# EAGLE design MRCS-Occupancy-Display (EAGLE 7.7.0)
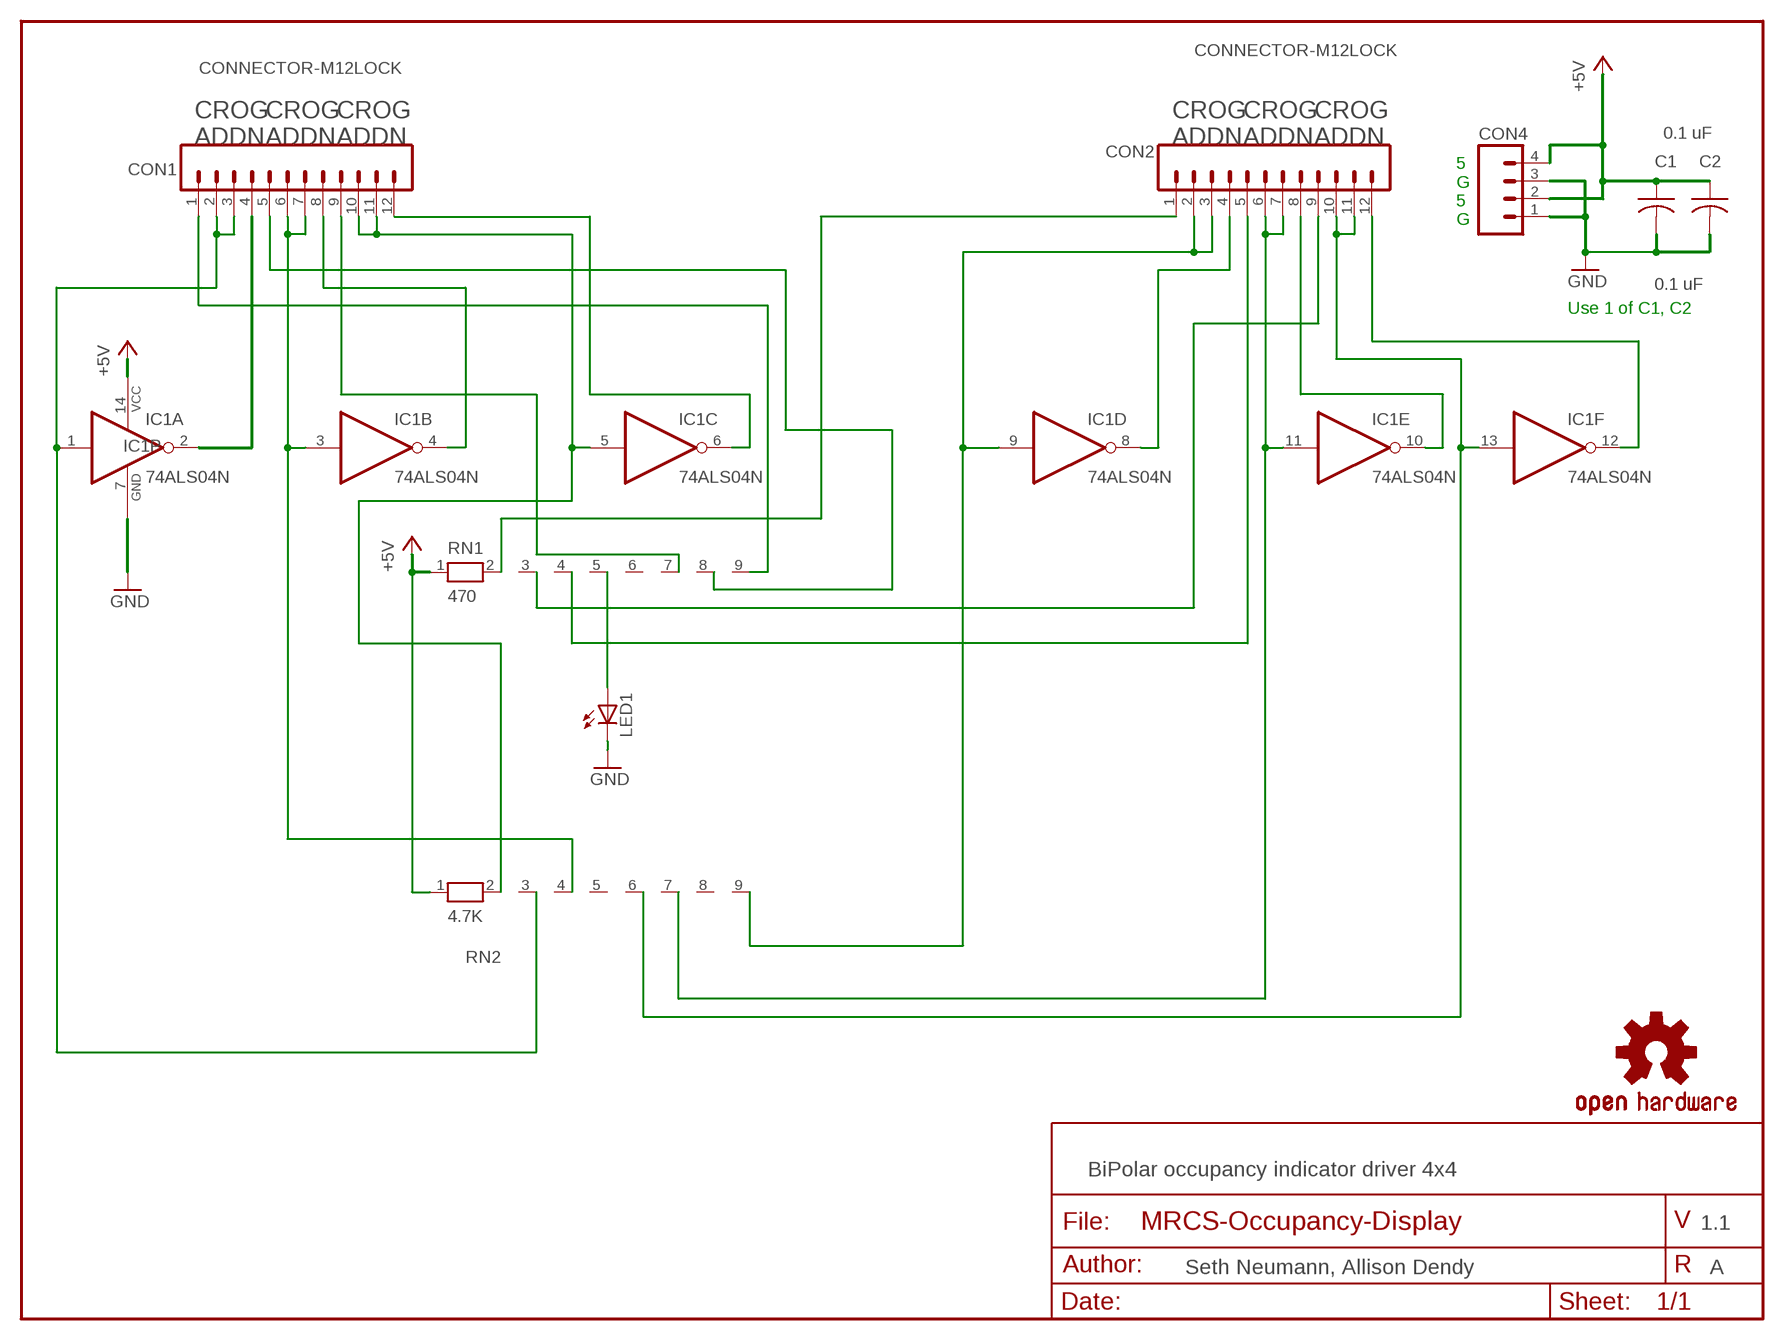
[diagram p0: schematic, sheet 1]

## Parts
C1  0.1 uF  CAPPTH2  [C-PTH-0.100]
C2  0.1 uF  CAPPTH1  [C050-024X044]
CON1  CONNECTOR-M12LOCK  [1X12_LOCK]
CON2  CONNECTOR-M12LOCK  [1X12_LOCK]
CON4  CONNECTOR-M04SCREW  [SCREWTERMINAL-3.5MM-4]
IC1  74ALS04N  [DIL14]
LED1  LEDLED3MM  [LED3MM]
OSHW1  DOC-OSHW-LOGO-M  [OSHW-LOGO-M]
RN1  470  RN08  [RN-9]
RN2  4.7K  RN08  [RN-9]

## Nets
GND: C1.2 C2.2 CON4.1 CON4.3 IC1.7(P:GND) LED1.K(C)
N$2: CON1.10 CON1.11 IC1.5(C:I) RN2.2
N$3: CON1.1 RN1.9
N$4: CON1.4 IC1.2(A:O)
N$5: CON1.6 CON1.7 IC1.3(B:I) RN2.4
N$6: CON1.12 IC1.6(C:O)
N$7: CON1.8 IC1.4(B:O)
N$8: CON1.5 RN1.8
N$9: CON2.2 CON2.3 IC1.9(D:I) RN2.9
N$10: CON1.9 RN1.7
N$11: CON2.8 IC1.10(E:O)
N$12: CON2.12 IC1.12(F:O)
N$13: CON2.4 IC1.8(D:O)
N$14: CON2.1 RN1.2
N$15: CON2.5 RN1.4
N$16: CON1.2 CON1.3 IC1.1(A:I) RN2.3
N$17: LED1.A RN1.5
N$18: CON2.6 CON2.7 IC1.11(E:I) RN2.7
N$19: CON2.9 RN1.3
N$20: CON2.10 CON2.11 IC1.13(F:I) RN2.6
VCC: C1.1 C2.1 CON4.2 CON4.4 IC1.14(P:VCC) RN1.1 RN2.1 ; supply symbol labelled +5V
Unconnected: RN1.6 RN2.5 RN2.8

## Notes on the sheet
- CROG
  ADDN
- CROG
  ADDN
- CROG
  ADDN
- CROG
  ADDN
- CROG
  ADDN
- CROG
  ADDN
- 5
  G
  5
  G
- Use 1 of C1, C2
- BiPolar occupancy indicator driver 4x4
- 1.1
- Seth Neumann, Allison Dendy | A

## Library data of the parts
C1 C2 = SPCoast:CAP*
CON1 CON2 = SPCoast:CONNECTOR-M12: Header 12 Standard 12-pin 0.1" header. Use with straight break away headers (SKU : PRT-00116), right angle break away headers (PRT-00553), swiss pins (PRT-00743), machine pins (PRT-00117), and female headers (PRT-00115).
CON4 = SPCoast:CONNECTOR-M04: Header 4 Standard 4-pin 0.1" header. Use with straight break away headers (SKU : PRT-00116), right angle break away headers (PRT-00553), swiss pins (PRT-00743), machine pins (PRT-00117), and female headers (PRT-00115). Molex polarized connector foot print use with SKU : PRT-08231 with associated crimp pins and housings. 1MM SMD Version SKU: PRT-10208
IC1 = 74xx-us:74*04: Hex INVERTER
LED1 = SPCoast:LED*
OSHW1 = SPCoast:DOC-OSHW-LOGO-: Open Source Hardware Logo This logo indicates the piece of hardware it is found on incorporates a OSHW license and/or adheres to the definition of open source hardware http://freedomdefined.org/OSHW Creative Commons - Attribution - ShareAlike 3.0
RN1 RN2 = resistor-net:RN08: RESISTOR NETWORK; OC_FARNELL: unknown; OC_NEWARK: unknown

## Board
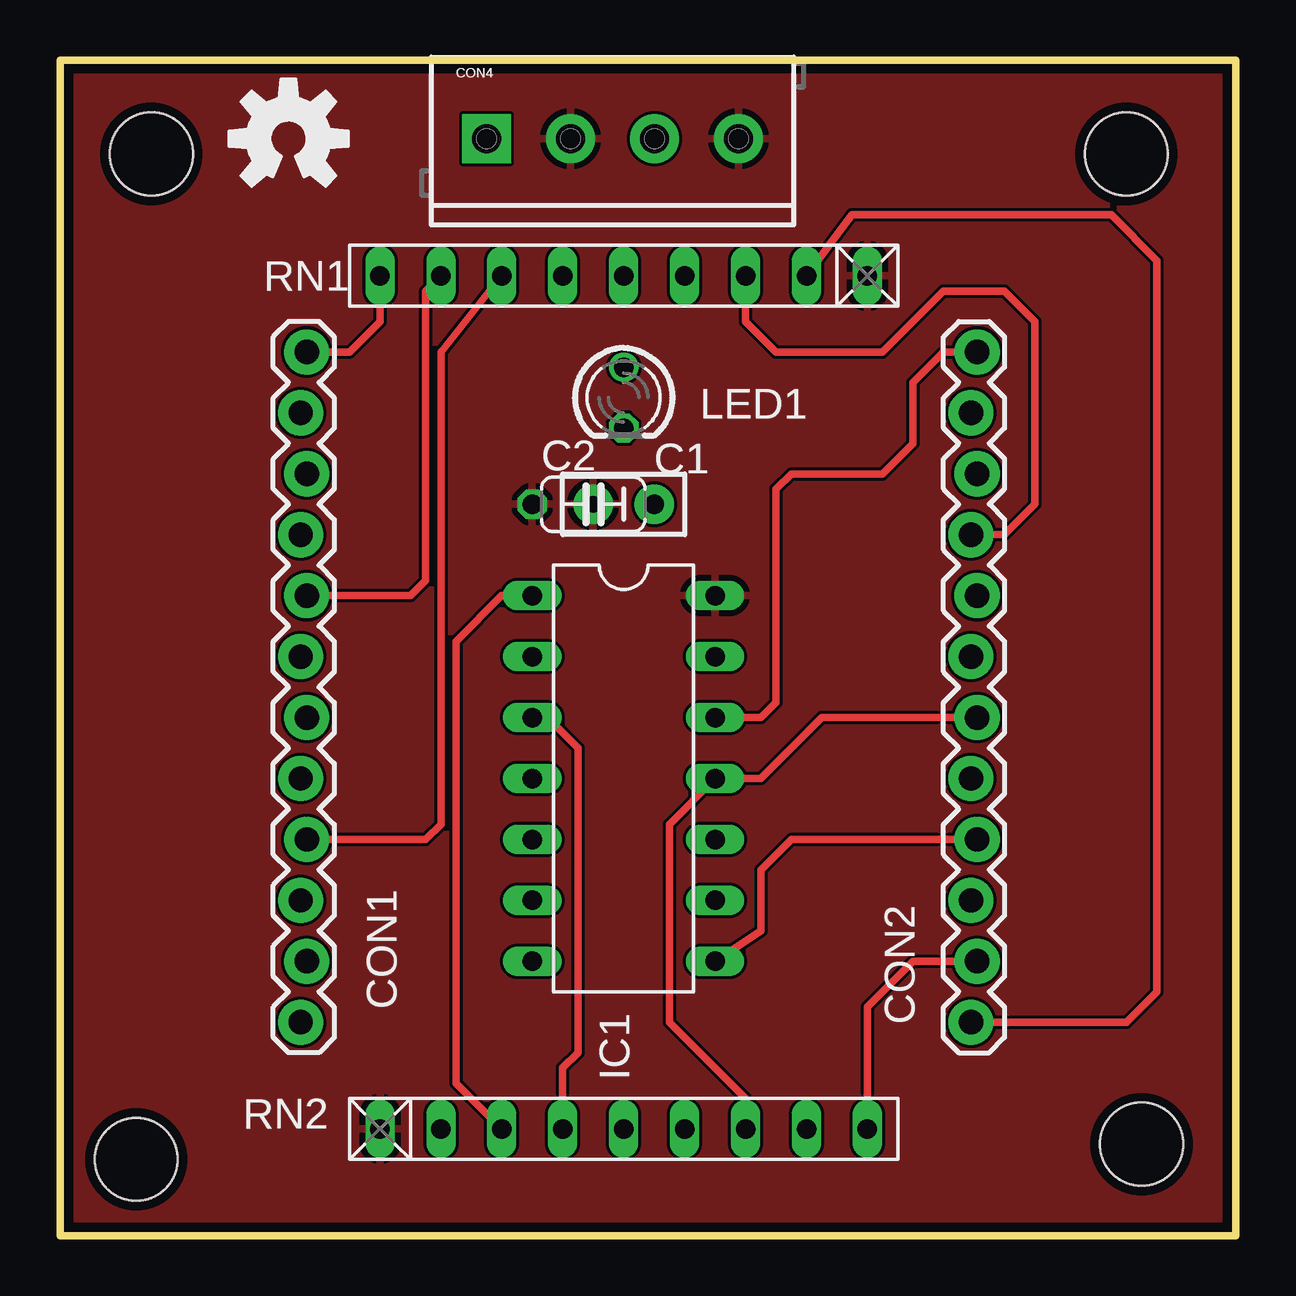
[diagram p1: board, top side]
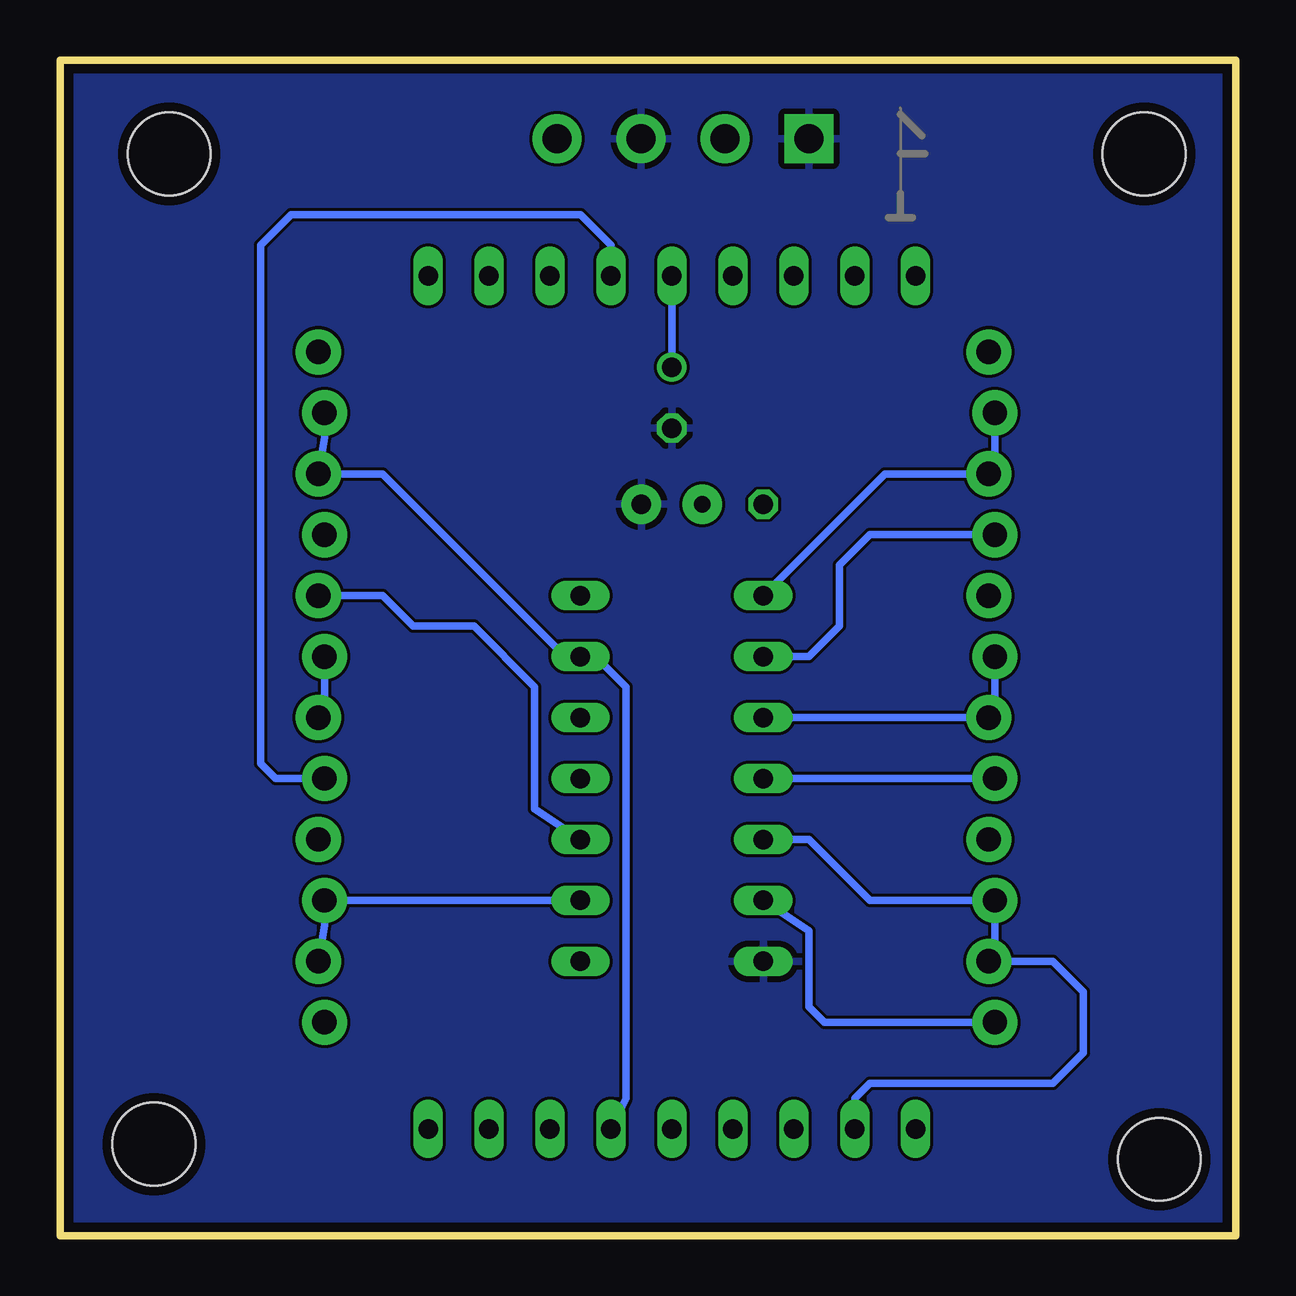
[diagram p2: board, bottom side, seen from below]

Size 49 x 49 mm. Coordinates in mm from the lower left corner, seen from the top.
Outline: 0,0 49,0 49,49 0,49 0,0
Copper layers (1*16): Top 0.035mm / dielectric 1.5mm / Bottom 0.035mm
Design rules "default *": minimum track width 5mil, minimum drill 0.2mm, track to track 5mil, track to pad 5mil, pad to pad 5mil, via to via 5mil, smd to smd 5mil, copper to edge 0.4mm, drill to drill 5mil, minimum pad ring 3mil, minimum via ring 3mil, stop-mask expansion 4mil, vias tented up to drill 0mil, thermal gap 10mil
Holes 3.45 mm at 3.81,45.09 44.45,45.09 45.09,3.81 3.17,3.17

### Footprints (pad centres in the part's own frame; a part is rotated, then mirrored left to right if it is on the bottom)
C-PTH-0.100 = drill 0.7 pad 1.651: 1 -1.27,0; 2 1.27,0
C050-024X044 = drill 0.813 octagon: 1 -2.54,0; 2 2.54,0
1X12_LOCK = drill 1.016 pad 1.88: 1 0,0.127; 2 2.54,-0.127; 3 5.08,0.127; 4 7.62,-0.127; 5 10.16,0.127; 6 12.7,-0.127; 7 15.24,0.127; 8 17.78,-0.127; 9 20.32,0.127; 10 22.86,-0.127; 11 25.4,0.127; 12 27.94,-0.127
SCREWTERMINAL-3.5MM-4 = drill 1.2 pad 2.032 square: 1 0,0 | drill 1.2 pad 2.032: 2 3.5,0; 3 7,0; 4 10.5,0
DIL14 = drill 0.813 long: 1 -7.62,-3.81; 2 -5.08,-3.81; 3 -2.54,-3.81; 4 0,-3.81; 5 2.54,-3.81; 6 5.08,-3.81; 7 7.62,-3.81; 8 7.62,3.81; 9 5.08,3.81; 10 2.54,3.81; 11 0,3.81; 12 -2.54,3.81; 13 -5.08,3.81; 14 -7.62,3.81
LED3MM = drill 0.813: A 1.27,0 | drill 0.813 octagon: K -1.27,0
RN-9 = drill 0.813 long: 1 -10.16,0; 2 -7.62,0; 3 -5.08,0; 4 -2.54,0; 5 0,0; 6 2.54,0; 7 5.08,0; 8 7.62,0; 9 10.16,0

### Placement (x,y rotation side)
C1  23.5,30.48 0 top
C2  22.23,30.48 0 top
CON1  10.16,36.83 270 top
CON2  38.1,8.89 90 top
CON4  17.78,45.72 0 top
IC1  23.5,19.05 270 top
LED1  23.5,34.92 90 top
OSHW1  9.53,45.72 0 top
RN1  23.5,40.01 180 top
RN2  23.5,4.45 0 top
U$1  [CA-PROP65WARNING]  45.09,25.4 90 top
U$2  [MRCSLOGOBTM]  7.62,41.91 0 top

### Tracks (layer width: path | path; a pad name or v marks a point on that pad's centre or on a via)
GND
  pour Bottom: 0,0 49,0 48.9,48.9 0,48.9
N$2
  Bottom 0.305: IC1.5 17.78,16.51 15.24,13.97 CON1.10 10.03,12.32 CON1.11 7.62,11.43 6.35,10.16 6.35,7.62 7.62,6.35 15.24,6.35 15.88,5.71 RN2.2
N$3
  Top 0.305: CON1.1 12.06,36.83 13.34,38.1 RN1.9
N$4
  Bottom 0.305: CON1.4 15.24,29.21 16.51,27.94 16.51,25.4 17.78,24.13 IC1.2
N$5
  Top 0.305: IC1.3 20.32,21.59 21.59,20.32 21.59,7.62 20.95,6.99 RN2.4
  Bottom 0.305: CON1.6 10.03,21.84 CON1.7 IC1.3
N$6
  Bottom 0.305: CON1.12 17.14,8.89 17.78,9.53 17.78,12.7 IC1.6
N$7
  Bottom 0.305: CON1.8 IC1.4
N$8
  Top 0.305: RN1.8 15.24,39.37 15.24,27.3 14.61,26.67 CON1.5
N$9
  Top 0.305: RN2.9 33.66,9.53 35.56,11.43 CON2.2
  Bottom 0.305: CON2.2 37.97,12.95 CON2.3 IC1.9
N$10
  Top 0.305: CON1.9 15.24,16.51 15.88,17.14 15.88,36.83 RN1.7
N$11
  Bottom 0.305: IC1.10 29.21,17.78 29.21,22.86 31.75,25.4 34.29,25.4 35.56,26.67 CON2.8
N$12
  Top 0.305: CON2.12 36.83,36.83 35.56,35.56 35.56,33.02 34.29,31.75 30.48,31.75 29.84,31.11 29.84,22.23 29.21,21.59 IC1.12
N$13
  Top 0.305: CON2.4 30.48,16.51 29.21,15.24 29.21,12.7 IC1.8
N$14
  Top 0.305: CON2.1 44.45,8.89 45.72,10.16 45.72,40.64 43.81,42.55 33.02,42.55 RN1.2
N$15
  Bottom 0.305: RN1.4 26.04,41.27 27.3,42.55 39.37,42.55 40.64,41.27 40.64,19.68 40.01,19.05 CON2.5
N$16
  Top 0.305: RN2.3 16.51,6.35 16.51,24.77 18.41,26.67 IC1.1
  Bottom 0.305: CON1.2 10.03,32 CON1.3 14.61,31.75 IC1.1
N$17
  Bottom 0.305: RN1.5 LED1.A
N$18
  Top 0.305: CON2.6 31.75,21.59 29.21,19.05 IC1.11 25.4,17.14 25.4,8.89 28.57,5.71 RN2.7
  Bottom 0.305: CON2.6 37.97,22.48 CON2.7
N$19
  Top 0.305: CON2.9 39.37,29.21 40.64,30.48 40.64,38.1 39.37,39.37 36.83,39.37 34.29,36.83 29.84,36.83 28.57,38.1 RN1.3
N$20
  Bottom 0.305: CON2.10 37.97,33.27 CON2.11 | 36.83,31.75 CON2.10 | CON2.10 35.56,31.75 27.94,24.13 IC1.13 26.67,24.13 25.4,22.86 25.4,5.71 RN2.6
VCC
  pour Top: 0,0 49,0 49,48.9 0,48.9

### Text on the board
tDocu: G 5 G 5 | CROG / ADDN | CROG / ADDN | CROG / ADDN | CROG / ADDN | CROG / ADDN | CROG / ADDN
bDocu: BiPolar LED Occupancy | V 1.1 / 20231103 | Seth Neumann / Allison Dendy
_tNames: CON4 | RN1 | LED1 | C2 | C1 | CON1 | CON2 | IC1 | RN2